# EAGLE design ADC_DSP (EAGLE 7.1.0)
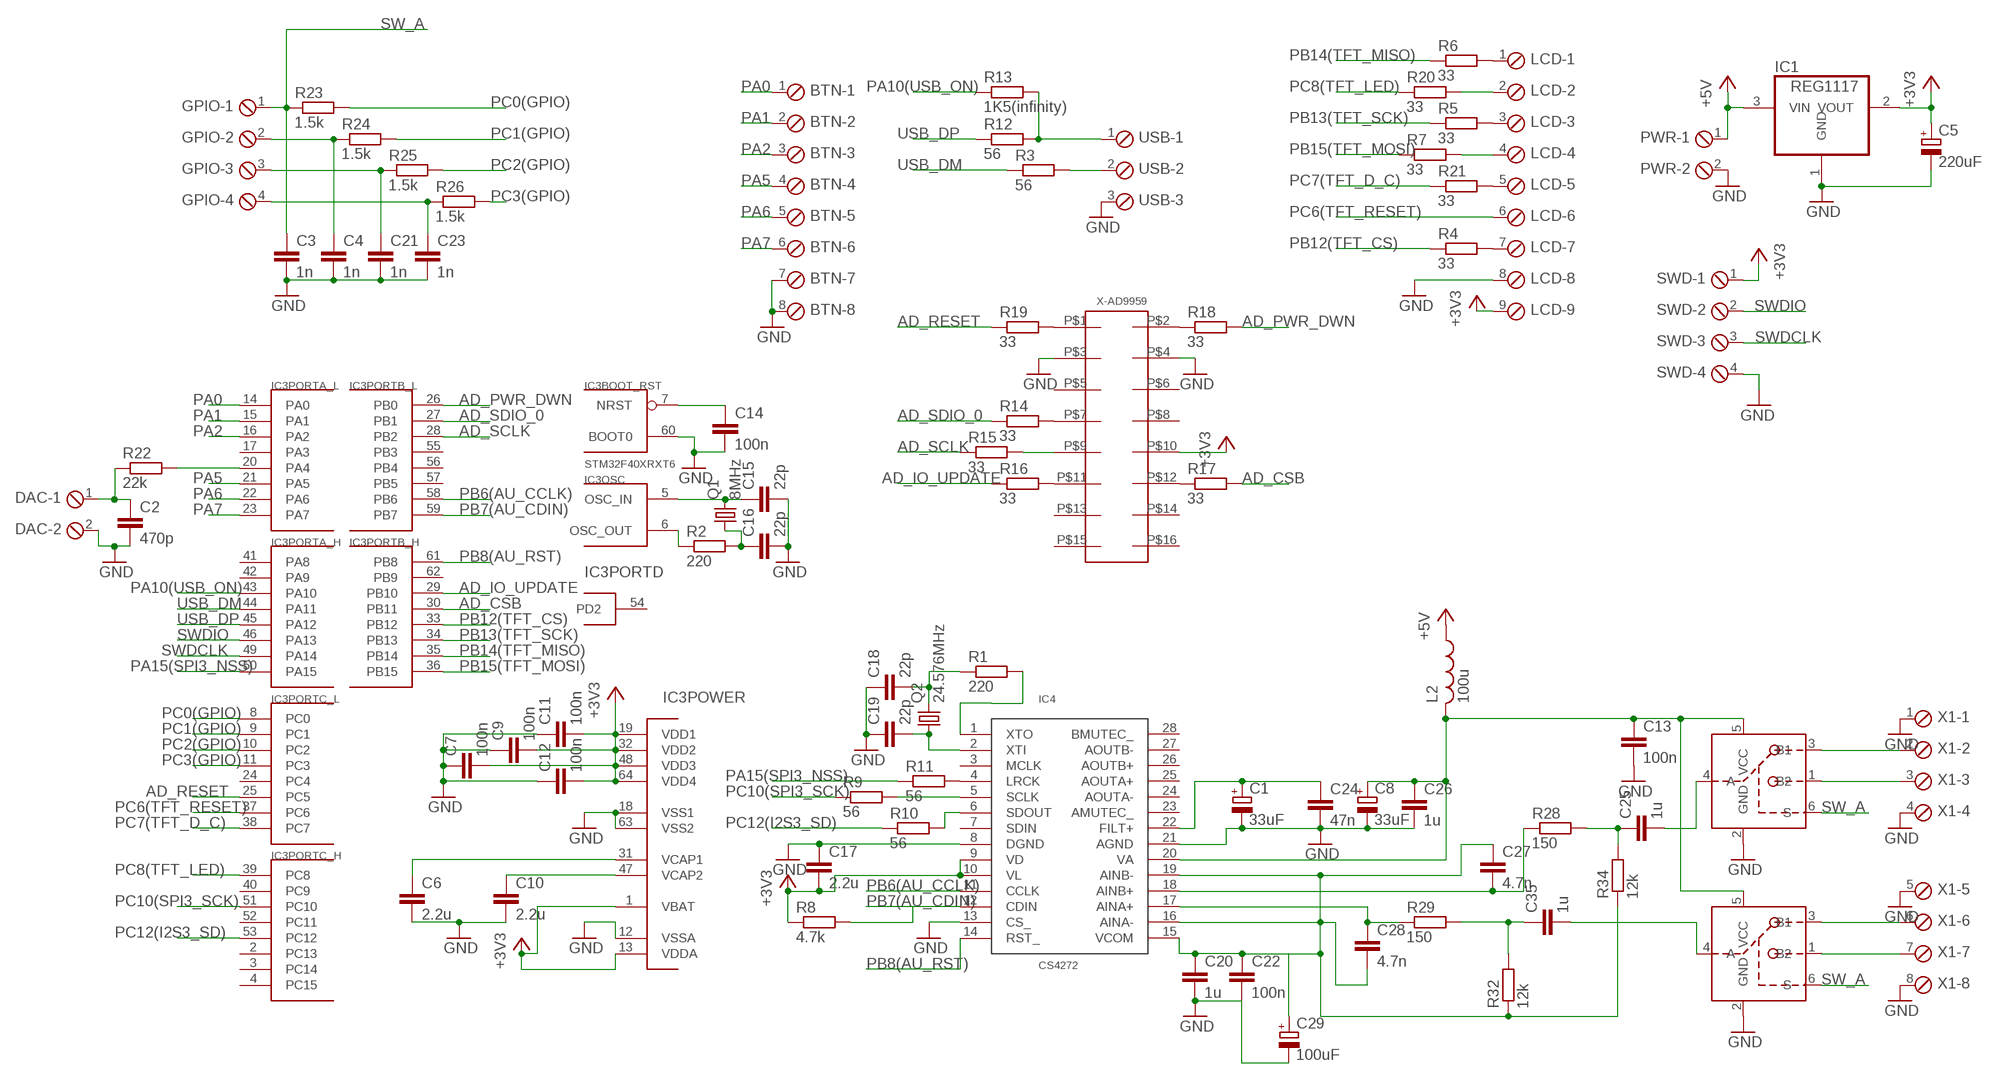
[diagram p0: schematic, sheet 1]

## Parts
BTN  MPT8  [8POL254]
C1  33uF  CPOL-EU153CLV-0605  [153CLV-0605]
C2  470p  C-EUC0805  [C0805]
C3  1n  C-EUC0805  [C0805]
C4  1n  C-EUC0805  [C0805]
C5  220uF  CPOL-EU153CLV-0605  [153CLV-0605]
C6  2.2u  C-EUC0603  [C0603]
C7  100n  C-EUC0603  [C0603]
C8  33uF  CPOL-EU153CLV-0605  [153CLV-0605]
C9  100n  C-EUC0603  [C0603]
C10  2.2u  C-EUC0603  [C0603]
C11  100n  C-EUC0603  [C0603]
C12  100n  C-EUC0603  [C0603]
C13  100n  C-EUC0603  [C0603]
C14  100n  C-EUC0603  [C0603]
C15  22p  C-EUC0603  [C0603]
C16  22p  C-EUC0603  [C0603]
C17  2.2u  C-EUC0603  [C0603]
C18  22p  C-EUC0603  [C0603]
C19  22p  C-EUC0603  [C0603]
C20  1u  C-EUC0603  [C0603]
C21  1n  C-EUC0805  [C0805]
C22  100n  C-EUC0603  [C0603]
C23  1n  C-EUC0805  [C0805]
C24  47n  C-EUC0805  [C0805]
C25  1u  C-EUC0603  [C0603]
C26  1u  C-EUC0603  [C0603]
C27  4.7n  C-EUC0805  [C0805]
C28  4.7n  C-EUC0805  [C0805]
C29  100uF  CPOL-EU153CLV-0605  [153CLV-0605]
C35  1u  C-EUC0603  [C0603]
DAC  MPT2  [2POL254]
GPIO  MPT4  [4POL254]
IC1  REG1117  [SOT223]
IC3  STM32F40XRXT6  [TQFP64]
IC4  CS4272  [TSSOP28]
L2  100u  L-US0207/12  [0207/12]
LCD  MPT9  [9POL254]
PWR  MPT2  [2POL254]
Q1  8MHz  CRYSTALHC49S  [HC49/S]
Q2  24.576MHz  CRYSTALHC49S  [HC49/S]
R1  220  R-EU_R0603  [R0603]
R2  220  R-EU_R0603  [R0603]
R3  56  R-EU_R0603  [R0603]
R4  33  R-EU_R0603  [R0603]
R5  33  R-EU_R0603  [R0603]
R6  33  R-EU_R0603  [R0603]
R7  33  R-EU_R0603  [R0603]
R8  4.7k  R-EU_R0603  [R0603]
R9  56  R-EU_R0603  [R0603]
R10  56  R-EU_R0603  [R0603]
R11  56  R-EU_R0603  [R0603]
R12  56  R-EU_R0603  [R0603]
R13  1K5(infinity)  R-EU_R0603  [R0603]
R14  33  R-EU_R0603  [R0603]
R15  33  R-EU_R0603  [R0603]
R16  33  R-EU_R0603  [R0603]
R17  33  R-EU_R0603  [R0603]
R18  33  R-EU_R0603  [R0603]
R19  33  R-EU_R0603  [R0603]
R20  33  R-EU_R0603  [R0603]
R21  33  R-EU_R0603  [R0603]
R22  22k  R-EU_R0603  [R0603]
R23  1.5k  R-EU_R0603  [R0603]
R24  1.5k  R-EU_R0603  [R0603]
R25  1.5k  R-EU_R0603  [R0603]
R26  1.5k  R-EU_R0603  [R0603]
R28  150  R-EU_R0603  [R0603]
R29  150  R-EU_R0603  [R0603]
R32  12k  R-EU_R0603  [R0603]
R34  12k  R-EU_R0603  [R0603]
SWD  MPT4  [4POL254]
U$1  SN74LVC1G3157DBVR  [SOT23-6]
U$2  SN74LVC1G3157DBVR  [SOT23-6]
USB  MPT3  [3POL254]
X1  MPT8  [8POL254]
X-AD9959  PIN8X2  [PIN8X2_SMD]

## Nets
4052_B: C4.1 GPIO.2 R24.1
+3V3: C5.+ C7.2 C9.2 C11.2 C12.2 C17.2 IC1.2(VOUT) IC3.1(POWER:VBAT) IC3.13(POWER:VDDA) IC3.19(POWER:VDD1) IC3.32(POWER:VDD2) IC3.48(POWER:VDD3) IC3.64(POWER:VDD4) IC4.9(VD) IC4.10(VL) LCD.9 R8.1 SWD.1 X-AD9959.P$10
+5V: IC1.3(VIN) L2.1 PWR.1
AD_CSB: IC3.30(PORTB_H:PB11) R17.2
AD_IO_UPDATE: IC3.29(PORTB_H:PB10) R16.1
AD_PWR_DWN: IC3.26(PORTB_L:PB0) R18.2
AD_RESET: IC3.25(PORTC_L:PC5) R19.1
AD_SCLK: IC3.28(PORTB_L:PB2) R15.1
AD_SDIO_0: IC3.27(PORTB_L:PB1) R14.1
AINB+: C27.2 IC4.18(AINB+) R28.1
AVCC: C8.+ C13.1 C26.1 IC4.20(VA) L2.2 U$1.5(VCC) U$2.5(VCC)
D+: R12.2 R13.2 USB.1
D-: R3.2 USB.2
GND: BTN.7 BTN.8 C1.- C2.2 C3.2 C4.2 C5.- C6.2 C7.1 C8.- C9.1 C10.2 C11.1 C12.1 C13.2 C14.2 C15.2 C16.2 C17.1 C18.1 C19.1 C20.2 C21.2 C22.2 C23.2 C24.2 C26.2 C29.- DAC.2 IC1.1(GND) IC3.12(POWER:VSSA) IC3.18(POWER:VSS1) IC3.60(BOOT_RST:BOOT0) IC3.63(POWER:VSS2) IC4.8(DGND) IC4.13(CS_) IC4.21(AGND) LCD.8 PWR.2 SWD.4 U$1.2(GND) U$2.2(GND) USB.3 X1.1 X1.4 X1.5 X1.8 X-AD9959.P$3 X-AD9959.P$4
N$1: C10.1 IC3.47(POWER:VCAP2)
N$2: C6.1 IC3.31(POWER:VCAP1)
N$4: C14.1 IC3.7(BOOT_RST:NRST)
N$5: C15.1 IC3.5(OSC:OSC_IN) Q1.2
N$6: C16.1 Q1.1 R2.2
N$7: C19.2 IC4.2(XTI) Q2.1
N$8: C18.2 Q2.2 R1.1
N$9: IC4.4(LRCK) R11.2
N$10: IC4.5(SCLK) R9.2
N$11: IC4.6(SDOUT) R10.2
N$12: C1.+ C24.1 IC4.22(FILT+)
N$13: C25.2 U$1.4(A)
N$14: R14.2 X-AD9959.P$7
N$15: C35.2 U$2.4(A)
N$17: IC4.1(XTO) R1.2
N$18: C28.1 IC4.17(AINA+) R29.1
N$19: IC3.6(OSC:OSC_OUT) R2.1
N$20: LCD.1 R6.2
N$21: LCD.3 R5.2
N$22: LCD.2 R20.2
N$23: R15.2 X-AD9959.P$9
N$24: LCD.4 R7.2
N$26: U$1.3(B1) X1.2
N$28: U$1.1(B2) X1.3
N$29: R16.2 X-AD9959.P$11
N$30: U$2.3(B1) X1.6
N$31: R17.1 X-AD9959.P$12
N$32: R18.1 X-AD9959.P$2
N$33: R19.2 X-AD9959.P$1
N$34: LCD.7 R4.2
N$35: LCD.5 R21.2
N$36: IC3.20(PORTA_L:PA4) R22.2
N$37: C2.1 DAC.1 R22.1
N$38: U$2.1(B2) X1.7
N$39: C25.1 R28.2 R34.2
N$40: C21.1 GPIO.3 R25.1
N$41: C23.1 GPIO.4 R26.1
N$50: C35.1 R29.2 R32.2
PA0: BTN.1 IC3.14(PORTA_L:PA0)
PA1: BTN.2 IC3.15(PORTA_L:PA1)
PA2: BTN.3 IC3.16(PORTA_L:PA2)
PA5: BTN.4 IC3.21(PORTA_L:PA5)
PA6: BTN.5 IC3.22(PORTA_L:PA6)
PA7: BTN.6 IC3.23(PORTA_L:PA7)
PA10(USB_ON): IC3.43(PORTA_H:PA10) R13.1
PA15(SPI3_NSS): IC3.50(PORTA_H:PA15) R11.1
PB6(AU_CCLK): IC3.58(PORTB_L:PB6) IC4.11(CCLK)
PB7(AU_CDIN): IC3.59(PORTB_L:PB7) IC4.12(CDIN) R8.2
PB8(AU_RST): IC3.61(PORTB_H:PB8) IC4.14(RST_)
PB12(TFT_CS): IC3.33(PORTB_H:PB12) R4.1
PB13(TFT_SCK): IC3.34(PORTB_H:PB13) R5.1
PB14(TFT_MISO): IC3.35(PORTB_H:PB14) R6.1
PB15(TFT_MOSI): IC3.36(PORTB_H:PB15) R7.1
PC0(GPIO): IC3.8(PORTC_L:PC0) R23.2
PC1(GPIO): IC3.9(PORTC_L:PC1) R24.2
PC2(GPIO): IC3.10(PORTC_L:PC2) R25.2
PC3(GPIO): IC3.11(PORTC_L:PC3) R26.2
PC6(TFT_RESET): IC3.37(PORTC_L:PC6) LCD.6
PC7(TFT_D_C): IC3.38(PORTC_L:PC7) R21.1
PC8(TFT_LED): IC3.39(PORTC_H:PC8) R20.1
PC10(SPI3_SCK): IC3.51(PORTC_H:PC10) R9.1
PC12(I2S3_SD): IC3.53(PORTC_H:PC12) R10.1
SW_A: C3.1 GPIO.1 R23.1 U$1.6(S) U$2.6(S)
SWDCLK: IC3.49(PORTA_H:PA14) SWD.3
SWDIO: IC3.46(PORTA_H:PA13) SWD.2
USB_DM: IC3.44(PORTA_H:PA11) R3.1
USB_DP: IC3.45(PORTA_H:PA12) R12.1
VCOM: C20.1 C22.1 C27.1 C28.2 C29.+ IC4.15(VCOM) IC4.16(AINA-) IC4.19(AINB-) R32.1 R34.1
Unconnected: IC3.2(PORTC_H:PC13) IC3.3(PORTC_H:PC14) IC3.4(PORTC_H:PC15) IC3.17(PORTA_L:PA3) IC3.24(PORTC_L:PC4) IC3.40(PORTC_H:PC9) IC3.41(PORTA_H:PA8) IC3.42(PORTA_H:PA9) IC3.52(PORTC_H:PC11) IC3.54(PORTD:PD2) IC3.55(PORTB_L:PB3) IC3.56(PORTB_L:PB4) IC3.57(PORTB_L:PB5) IC3.62(PORTB_H:PB9) IC4.3(MCLK) IC4.7(SDIN) IC4.23(AMUTEC_) IC4.24(AOUTA-) IC4.25(AOUTA+) IC4.26(AOUTB+) IC4.27(AOUTB-) IC4.28(BMUTEC_) X-AD9959.P$5 X-AD9959.P$6 X-AD9959.P$8 X-AD9959.P$13 X-AD9959.P$14 X-AD9959.P$15 X-AD9959.P$16

## Library data of the parts
BTN X1 = con-phoenix-254:MPT8: PHOENIX CONNECTOR; OC_FARNELL: unknown; OC_NEWARK: unknown
C1 C5 C8 C29 = rcl:CPOL-EU: POLARIZED CAPACITOR, European symbol
C2-C4 C6 C7 C9-C28 C35 = rcl:C-EU: CAPACITOR, European symbol
DAC PWR = con-phoenix-254:MPT2: PHOENIX CONNECTOR; OC_FARNELL: unknown; OC_NEWARK: unknown
GPIO SWD = con-phoenix-254:MPT4: PHOENIX CONNECTOR; OC_FARNELL: unknown; OC_NEWARK: unknown
IC1 = burr-brown:REG1117: 800mA and 1A Low Dropout (LDO) Positive Regulator 1.8V, 2.5V, 2.85V, 3.3V, 5V, and Adj; MPN: REG1117; OC_FARNELL: 1097566; OC_NEWARK: 14P6981
IC3 = stm32:STM32F40XRXT6: STM32F40X LQFP64
IC4 = balmer:CS4272: 24-Bit, 192 kHz Stereo Audio CODEC
L2 = rcl:L-US: INDUCTOR, American symbol
LCD = con-phoenix-254:MPT9: PHOENIX CONNECTOR; OC_FARNELL: unknown; OC_NEWARK: unknown
Q1 Q2 = crystal:CRYSTAL: CRYSTAL; OC_FARNELL: 1667008; OC_NEWARK: unknown
R1-R26 R28 R29 R32 R34 = rcl:R-EU_: RESISTOR, European symbol
U$1 U$2 = balmer:SN74LVC1G3157DBVR: SINGLE-POLE DOUBLE-THROW ANALOG SWITCH
USB = con-phoenix-254:MPT3: PHOENIX CONNECTOR; OC_FARNELL: unknown; OC_NEWARK: unknown
X-AD9959 = balmer:PIN8X2: 2.54mm pins dual

## Board
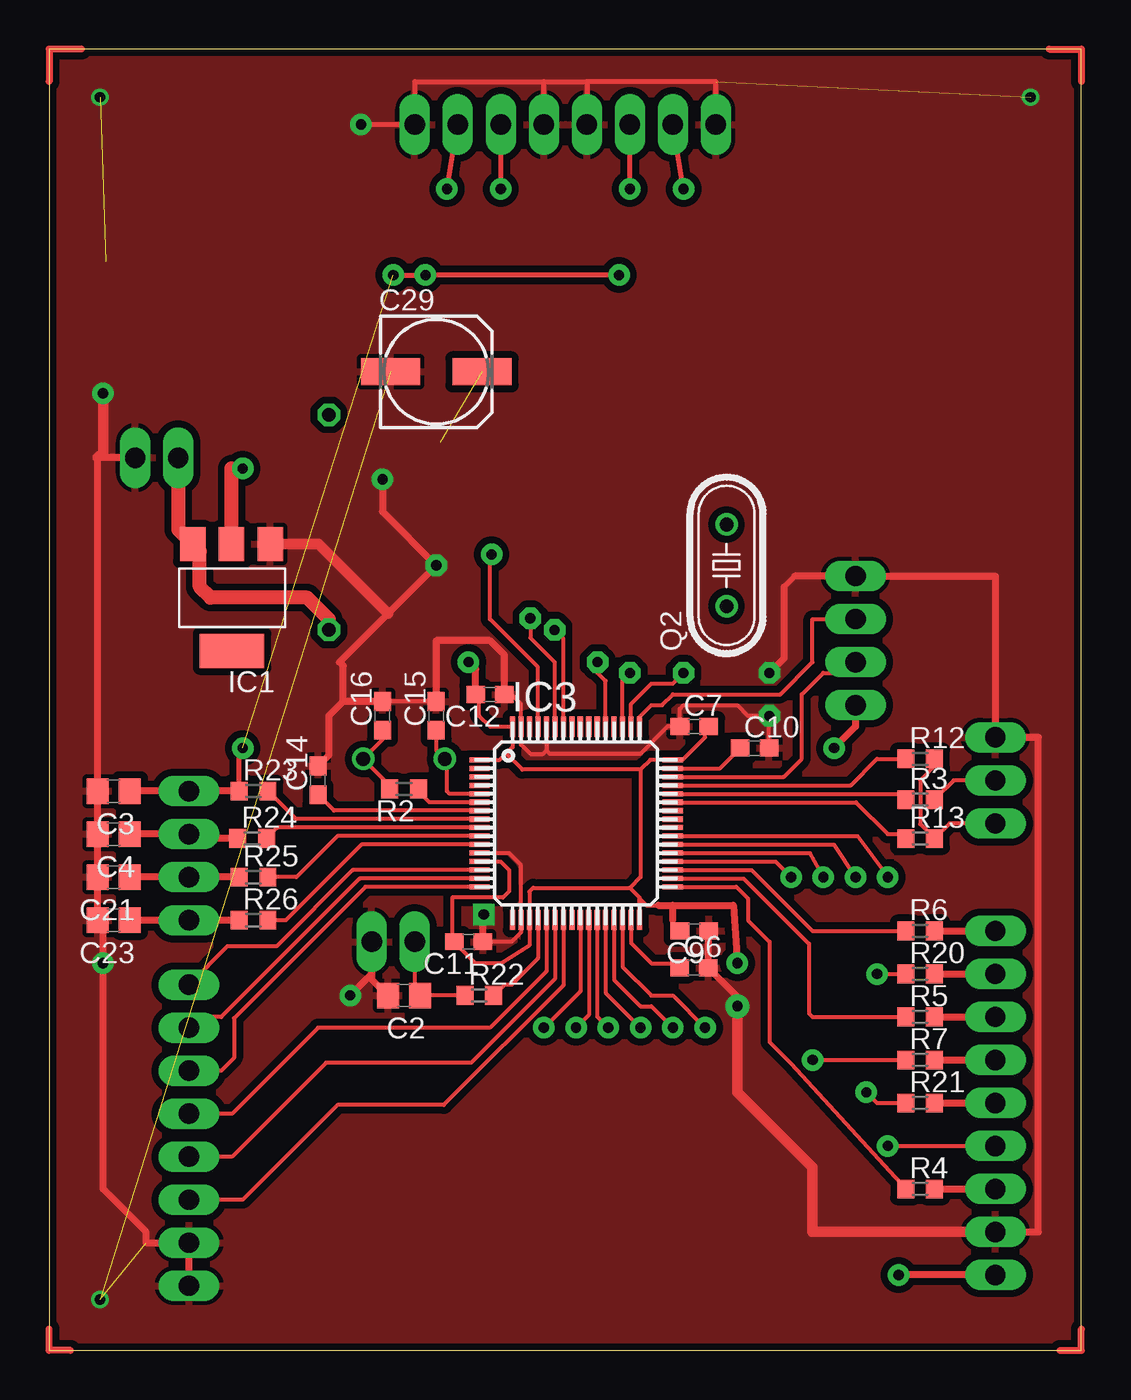
[diagram p1: board, top side]
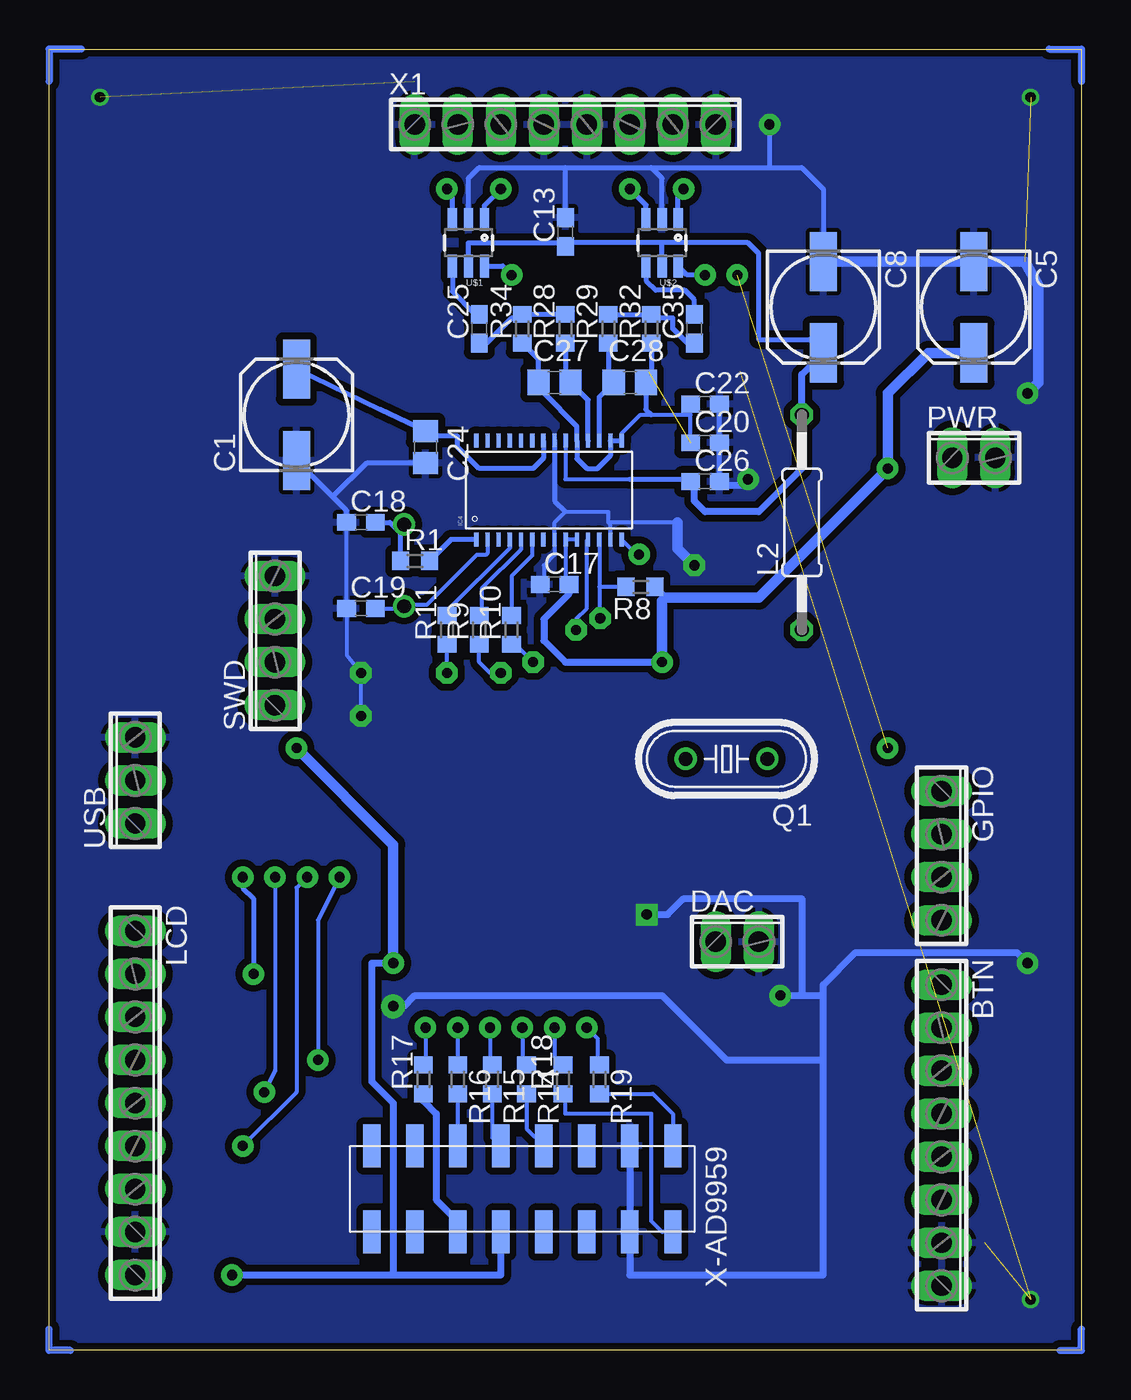
[diagram p2: board, bottom side, seen from below]

Size 60.95 x 76.83 mm. Coordinates in mm from the lower left corner, seen from the top.
Outline: 0,0 60.95,0 60.95,76.83 0,76.83 0,0
Copper layers (1*16): Top 0.035mm / dielectric 1.5mm / Bottom 0.035mm
Design rules "ITEADstudio_DRC": minimum track width 6mil, minimum drill 12mil, track to track 6mil, track to pad 6mil, pad to pad 6mil, via to via 6mil, smd to smd 0mil, copper to edge 10mil, drill to drill 10mil, minimum pad ring 10mil, minimum via ring 6mil, stop-mask expansion 2mil, vias tented up to drill 100mil, thermal gap 10mil

### Footprints (pad centres in the part's own frame; a part is rotated, then mirrored left to right if it is on the bottom)
8POL254 = drill 1.2 long: 1 -8.89,0; 2 -6.35,0; 3 -3.81,0; 4 -1.27,0; 5 1.27,0; 6 3.81,0; 7 6.35,0; 8 8.89,0
153CLV-0605 = smd 3.5 x 1.6: + 2.7,0; - -2.7,0
C0805 = smd 1.3 x 1.5: 1 -0.95,0; 2 0.95,0
C0603 = smd 1.1 x 1: 1 -0.85,0; 2 0.85,0
2POL254 = drill 1.2 long: 1 -1.27,0; 2 1.27,0
4POL254 = drill 1.2 long: 1 -3.81,0; 2 -1.27,0; 3 1.27,0; 4 3.81,0
SOT223 = smd 1.499 x 2.007: 1 -2.261,-3.15; 2 0.025,-3.15; 3 2.311,-3.15 | smd 3.81 x 2.007: 4 0,3.15
TQFP64 = smd 1.2 x 0.3: 1 -5.7,3.75; 2 -5.7,3.25; 3 -5.7,2.75; 4 -5.7,2.25; 5 -5.7,1.75; 6 -5.7,1.25; 7 -5.7,0.75; 8 -5.7,0.25; 9 -5.7,-0.25; 10 -5.7,-0.75; 11 -5.7,-1.25; 12 -5.7,-1.75; 13 -5.7,-2.25; 14 -5.7,-2.75; 15 -5.7,-3.25; 16 -5.7,-3.75; 33 5.7,-3.75; 34 5.7,-3.25; 35 5.7,-2.75; 36 5.7,-2.25; 37 5.7,-1.75; 38 5.7,-1.25; 39 5.7,-0.75; 40 5.7,-0.25; 41 5.7,0.25; 42 5.7,0.75; 43 5.7,1.25; 44 5.7,1.75; 45 5.7,2.25; 46 5.7,2.75; 47 5.7,3.25; 48 5.7,3.75 | smd 0.3 x 1.2: 17 -3.75,-5.7; 18 -3.25,-5.7; 19 -2.75,-5.7; 20 -2.25,-5.7; 21 -1.75,-5.7; 22 -1.25,-5.7; 23 -0.75,-5.7; 24 -0.25,-5.7; 25 0.25,-5.7; 26 0.75,-5.7; 27 1.25,-5.7; 28 1.75,-5.7; 29 2.25,-5.7; 30 2.75,-5.7; 31 3.25,-5.7; 32 3.75,-5.7; 49 3.75,5.7; 50 3.25,5.7; 51 2.75,5.7; 52 2.25,5.7; 53 1.75,5.7; 54 1.25,5.7; 55 0.75,5.7; 56 0.25,5.7; 57 -0.25,5.7; 58 -0.75,5.7; 59 -1.25,5.7; 60 -1.75,5.7; 61 -2.25,5.7; 62 -2.75,5.7; 63 -3.25,5.7; 64 -3.75,5.7
TSSOP28 = smd 0.8 x 0.25: 1 -2.921,4.623; 2 -2.921,3.962; 3 -2.921,3.302; 4 -2.921,2.642; 5 -2.921,1.981; 6 -2.921,1.321; 7 -2.921,0.66; 8 -2.927,0; 9 -2.921,-0.66; 10 -2.921,-1.321; 11 -2.921,-1.981; 12 -2.921,-2.642; 13 -2.921,-3.302; 14 -2.921,-3.962; 15 2.921,-3.962; 16 2.921,-3.302; 17 2.921,-2.642; 18 2.921,-1.981; 19 2.921,-1.321; 20 2.921,-0.66; 21 2.927,0; 22 2.921,0.66; 23 2.921,1.321; 24 2.921,1.981; 25 2.921,2.642; 26 2.921,3.302; 27 2.921,3.962; 28 2.921,4.623
0207/12 = drill 0.813 octagon: 1 -6.35,0; 2 6.35,0
9POL254 = drill 1.2 long: 1 -10.16,0; 2 -7.62,0; 3 -5.08,0; 4 -2.54,0; 5 0,0; 6 2.54,0; 7 5.08,0; 8 7.62,0; 9 10.16,0
HC49/S = drill 0.813: 1 -2.413,0; 2 2.413,0
R0603 = smd 1 x 1.1: 1 -0.85,0; 2 0.85,0
SOT23-6 = smd 0.55 x 1.35: 1 -0.95,-1.375; 2 0,-1.375; 3 0.95,-1.375; 4 0.95,1.375; 5 0,1.375; 6 -0.95,1.375
3POL254 = drill 1.2 long: 1 -2.54,0; 2 0,0; 3 2.54,0
PIN8X2_SMD = smd 2.54 x 1.016: P$1 -2.54,8.89; P$2 2.54,8.89; P$3 -2.54,6.35; P$4 2.54,6.35; P$5 -2.54,3.81; P$6 2.54,3.81; P$7 -2.54,1.27; P$8 2.54,1.27; P$9 -2.54,-1.27; P$10 2.54,-1.27; P$11 -2.54,-3.81; P$12 2.54,-3.81; P$13 -2.54,-6.35; P$14 2.54,-6.35; P$15 -2.54,-8.89; P$16 2.54,-8.89

### Placement (x,y rotation side)
BTN  8.26,12.7 270 bottom
C1  46.35,55.24 90 bottom
C2  20.95,20.95 180 top
C3  3.81,33.02 180 top
C4  3.81,30.48 180 top
C5  6.35,61.59 270 bottom
C6  38.08,22.59 0 top
C7  38.1,36.83 0 top
C8  15.24,61.59 270 bottom
C9  38.1,24.77 180 top
C10  41.66,35.56 0 top
C11  24.77,24.13 180 top
C12  26.04,38.73 180 top
C13  30.48,66.04 90 bottom
C14  15.88,33.66 90 top
C15  22.86,37.47 90 top
C16  19.68,37.47 90 top
C17  31.11,45.22 0 bottom
C18  42.55,48.9 0 bottom
C19  42.55,43.81 0 bottom
C20  22.23,53.59 0 bottom
C21  3.81,27.94 180 top
C22  22.23,55.88 0 bottom
C23  3.81,25.4 180 top
C24  38.73,53.34 270 bottom
C25  35.56,60.33 90 bottom
C26  22.23,51.3 0 bottom
C27  31.11,57.15 0 bottom
C28  26.67,57.15 0 bottom
C29  22.86,57.78 0 top
C35  22.86,60.33 90 bottom
DAC  20.32,24.13 0 bottom
GPIO  8.26,29.21 270 bottom
IC1  10.79,44.45 180 top
IC3  31.11,31.11 0 top
IC4  31.11,50.8 90 bottom
L2  16.51,48.9 90 bottom
LCD  55.88,14.61 270 bottom
PWR  6.35,52.7 0 bottom
Q1  20.95,34.92 180 bottom
Q2  40.01,46.35 90 top
R1  39.35,46.62 0 bottom
R2  20.95,33.15 180 top
R3  51.44,32.52 0 top
R4  51.44,9.53 0 top
R5  51.44,19.68 0 top
R6  51.44,24.77 0 top
R7  51.44,17.14 0 top
R8  26.04,45.09 180 bottom
R9  35.56,42.55 90 bottom
R10  33.66,42.55 90 bottom
R11  37.47,42.55 90 bottom
R12  51.44,34.92 0 top
R13  51.44,30.22 0 top
R14  32.77,16 270 bottom
R15  34.8,16 270 bottom
R16  36.83,16 270 bottom
R17  38.86,16 90 bottom
R18  30.61,16 90 bottom
R19  28.46,16 270 bottom
R20  51.44,22.23 0 top
R21  51.44,14.61 0 top
R22  25.4,20.95 0 top
R23  12.06,33.02 0 top
R24  11.98,30.23 0 top
R25  12.06,27.94 0 top
R26  12.06,25.4 0 top
R28  30.48,60.33 90 bottom
R29  27.94,60.33 90 bottom
R32  25.4,60.33 90 bottom
R34  33.02,60.33 90 bottom
SWD  47.62,41.91 90 bottom
U$1  36.2,65.41 180 bottom
U$2  24.77,65.41 180 bottom
USB  55.88,33.66 90 bottom
X1  30.48,72.39 0 bottom
X-AD9959  33.02,9.53 270 bottom

### Tracks (layer width: path | path; a pad name or v marks a point on that pad's centre or on a via)
4052_B
  Top 0.406: R24.1 8.51,30.23 GPIO.2 C4.1
+3V3  (via drill 0.6 pad 1.27)
  Top 0.25: 34.29,27.3 28.57,27.3 28.36,27.09 IC3.19 28.36,23.92 26.67,22.86 25.18,22.86 C11.2 | IC3.32 34.87,26.67 | 34.87,26.67 34.87,26.73 34.29,27.3 | 34.92,34.29 35.5,34.87 IC3.48 37.41,34.87 38.73,36.2 38.73,36.62 C7.2 | 34.92,34.29 34.92,27.94 34.29,27.3 | C12.2 25.4,38.52 25.4,37.47 26.05,36.81 IC3.64 27.36,35.62 26.99,35.24 | IC3.1 26.61,34.87 26.99,35.24 | 34.92,34.29 27.94,34.29 26.99,35.24 | 34.87,26.67 35.26,26.27 35.95,26.27 | 36.83,25.4 36.83,25.18 C9.2 | IC3.13 26.66,28.86 27.17,28.36 27.17,27.11 26.8,26.73 23.8,26.73 23.8,24.25 C11.2 | 24.13,24.34 C11.2
  Top 0.406: 35.95,26.27 36.83,26.27 | 36.83,26.27 40.4,26.27 v40.64,22.86 | LCD.9 v50.16,4.45 | SWD.1 47.62,36.83 v46.35,35.56 | 36.83,25.4 36.83,26.27 | v11.43,52.07 10.77,52.07 | C12.2 25.18,40.22 v24.77,40.64
  Top 0.813: IC1.2 10.77,52.07
  Bottom 0.25: IC4.10 IC4.9 30.45,45.41 C17.2
  Bottom 0.406: X-AD9959.P$10 34.29,4.45 40.64,4.45 | v50.16,4.45 40.64,4.45 | R8.1 24.55,44.45 24.77,44.23 | C17.2 30.27,44.66 31.75,43.18 31.75,41.91 30.48,40.64 v24.77,40.64 | v40.64,22.86 41.91,22.86 41.91,15.88 40.64,14.61 40.64,4.45
  Bottom 0.61: v24.77,40.64 24.77,44.23 | 24.55,44.45 19.05,44.45 v11.43,52.07 11.43,56.52 9.05,58.9 C5.+ | v40.64,22.86 40.64,29.84 v46.35,35.56
+5V
  Top 0.813: PWR.1 7.62,48.46 IC1.3 8.89,47.19 8.89,45.09 9.53,44.45 15.24,44.45 16.51,43.18 L2.1
AD_CSB  (via drill 0.6 pad 1.27)
  Top 0.25: IC3.30 33.87,22.65 35.56,20.95 36.83,20.95 v38.73,19.05
  Bottom 0.25: v38.73,19.05 38.73,16.98 R17.2
AD_IO_UPDATE  (via drill 0.6 pad 1.27)
  Top 0.25: IC3.29 33.37,21.88 34.92,20.32 35.56,20.32 v36.83,19.05
  Bottom 0.25: v36.83,19.05 R16.1
AD_PWR_DWN  (via drill 0.6 pad 1.27)
  Top 0.25: IC3.26 31.86,19.8 v31.11,19.05
  Bottom 0.25: v31.11,19.05 31.11,17.35 R18.2
AD_RESET  (via drill 0.6 pad 1.27)
  Top 0.25: IC3.25 31.36,21.2 v29.21,19.05
  Bottom 0.25: v29.21,19.05 28.57,18.41 28.57,16.96 R19.1
AD_SCLK  (via drill 0.6 pad 1.27)
  Top 0.25: IC3.28 32.87,21.11 v34.92,19.05
  Bottom 0.25: v34.92,19.05 34.92,16.98 R15.1
AD_SDIO_0  (via drill 0.6 pad 1.27)
  Top 0.25: IC3.27 32.37,19.7 v33.02,19.05
  Bottom 0.25: v33.02,19.05 33.02,17.1 R14.1
AINB+
  Bottom 0.305: IC4.18 29.13,56.12 C27.2 30.48,57.47 R28.1
AVCC
  Bottom 0.25: IC4.20 30.45,51.46 30.48,51.44 26.67,51.44
  Bottom 0.305: C8.+ 16.04,59.69 19.05,59.69 19.05,64.77 19.68,65.41 24.77,65.41 | U$2.5 24.77,65.41 | 24.77,65.41 30.27,65.41 C13.1 30.7,65.41 36.2,65.41 U$1.5 | 26.67,51.44 23.21,51.44 C26.1
  Bottom 0.406: C8.+ 16.51,57.62 L2.2 16.51,52.07 19.05,49.53 22.23,49.53 22.86,50.16 22.86,51.09 C26.1
D+
  Top 0.25: R12.2 52.28,34.51 51.44,33.66 51.44,31.07 R13.2 53.18,31.11 USB.1
D-
  Top 0.25: USB.2 53.42,33.66 R3.2
GND  (via drill 0.6 pad 1.02, 0.6 pad 1.27, 0.6 pad 1.42)  (4 unrouted)
  Top 0.25: C12.1 27.3,38.73 27.86,38.17 IC3.63 27.86,35.77 28.41,35.23 29.16,35.23 29.36,35.42 | IC3.60 29.36,35.42 | 29.36,35.42 29.57,35.23 34.91,35.23 36.52,36.83 C7.1 37.25,37.88 37.47,38.1 40.64,38.1 41.27,37.47 v42.55,37.47 42.51,37.43 C10.2 | C15.2 C16.2 | C11.1 27.3,24.13 27.86,24.69 IC3.18 27.86,28.65 27.15,29.36 IC3.12
  Top 0.305: X1.1 39.37,74.93 31.75,74.93 | 31.75,74.93 X1.4 | X1.5 29.21,74.93 | 29.21,74.93 31.75,74.93 | 29.21,74.93 21.59,74.93 X1.8 v18.41,72.39 | 43.4,45.09 44.03,45.72
  Top 0.406: C16.2 17.36,38.31 | 17.36,38.31 16.51,37.47 16.51,35.14 C14.2 | DAC.2 19.05,22.23 | 19.05,22.23 v17.78,20.95 | 19.05,22.23 19.05,21.91 C2.2 | BTN.8 BTN.7 5.71,6.35 5.71,6.99 3.17,9.53 v3.17,22.86 3.17,25.09 C23.2 C21.2 C4.2 C3.2 2.86,52.7 PWR.2 | C11.1 25.61,25.68 v25.67,25.73 | v40.64,20.32 40.64,20.88 C6.2 38.93,24.75 C9.1 | 43.4,45.09 43.4,40.85 v42.55,40.01 | LCD.8 58.42,6.99 58.42,36.2 USB.3 55.88,45.72 SWD.4 44.03,45.72 | 17.36,38.31 17.36,40.42 17.14,40.64 20,43.5 v22.86,46.35 19.68,49.53 v19.68,51.44 | C12.1 26.89,41.06 26.04,41.91 22.86,41.91 C15.2
  Top 0.61: v3.17,56.52 3.17,53.02 2.86,52.7 | IC1.1 15.9,47.6 20,43.5 | v40.64,20.32 40.64,15.24 45.09,10.79 45.09,6.99 LCD.8
  Bottom 0.25: C18.1 C19.1 43.4,41.06 v42.55,40.01 v42.55,37.47 | C17.1 31.75,45.44 31.75,46.35 31.11,46.99 IC4.8 31.11,48.9 30.48,49.53 27.94,49.53 27.94,48.9 | 23.86,48.9 27.94,48.9 | IC4.13 27.81,48.77 27.94,48.9
  Bottom 0.305: IC4.21 31.11,50.16 30.48,49.53 | C22.2 C20.2 C26.2 21.59,51.09 | C18.1 43.4,49.59 44.21,50.4 | 44.21,50.4 C1.- | U$1.2 36.2,69.22 35.56,69.85 30.48,69.85 | 30.48,69.85 25.4,69.85 | 25.4,69.85 18.41,69.85 | 18.41,69.85 16.51,69.85 15.24,68.58 C8.- | C13.2 30.48,69.85 | U$2.2 24.77,69.22 25.4,69.85 | v18.41,72.39 18.41,69.85 | C24.2 42.23,52.39 44.21,50.4
  Bottom 0.406: 23.23,46.72 v22.86,46.35 | v17.78,20.95 16.51,20.95 | 16.51,20.95 15.24,20.95 | v25.67,25.73 24.43,25.73 23.5,26.67 16.51,26.67 16.51,20.95 | 15.24,17.14 15.24,4.45 26.67,4.45 X-AD9959.P$4 X-AD9959.P$3 | 15.24,17.14 15.24,20.95 | v40.64,20.32 40.01,20.32 39.37,20.95 24.77,20.95 20.95,17.14 15.24,17.14 | 21.59,51.09 20.04,51.09 v19.68,51.44 | 15.24,20.95 15.24,21.59 13.34,23.5 3.81,23.5 v3.17,22.86
  Bottom 0.61: v3.17,56.52 2.54,57.15 2.54,62.87 3.33,64.3 C5.- C8.- | 23.86,48.9 23.86,47.35 23.23,46.72
  other vias: 3,74 57.96,74 3,3
  pour Bottom (isolate 0.406): 0,77.47 60.96,77.47 60.96,-0.64 0,-0.64
  pour Top (isolate 0.406): 0,77.47 60.96,77.47 60.96,-0.64 0,-0.64
N$1
  Top 0.25: IC3.47 39.62,34.37 C10.1
N$2
  Top 0.25: IC3.31 34.37,24.05 35.56,22.86 36.96,22.86 C6.1
N$4
  Top 0.25: C14.1 16.82,31.86 IC3.7
N$5
  Top 0.25: IC3.5 23.65,32.87 23.5,33.02 23.5,34.8 Q1.2 22.86,35.43 C15.1
N$6
  Top 0.25: C16.1 19.68,36.07 Q1.1 20.11,33.36 R2.2
N$7
  Bottom 0.25: C19.2 40.13,43.81 Q2.1 39.92,44.02 38.66,44.02 35.71,46.98 35.16,46.98 35.08,47.06 IC4.2
N$8
  Bottom 0.305: R1.1 40.2,48.26 | 40.2,48.26 40.2,48.57 Q2.2 | C18.2 40.84,48.9 40.2,48.26
N$9
  Bottom 0.25: IC4.4 33.76,47.38 37.47,43.67 R11.2
N$10
  Bottom 0.25: IC4.5 33.1,47.29 35.41,44.98 35.41,43.54 R9.2
N$11
  Bottom 0.25: IC4.6 32.44,46.94 33.66,45.72 R10.2
N$12
  Bottom 0.305: IC4.22 31.77,52.68 32.38,52.07 35.56,52.07 36.83,53.34 36.83,53.98 38.42,53.98 C24.1 41.43,55.56 C1.+
N$13
  Bottom 0.305: C25.2 35.77,61.17 37.15,62.55 U$1.4
N$14
  Bottom 0.25: R14.2 32.77,13.09 X-AD9959.P$7
N$15
  Bottom 0.305: C35.2 22.86,62.05 23.42,62.6 25.14,62.6 25.71,63.18 U$2.4
N$17
  Bottom 0.305: IC4.1 37.24,47.88 R1.2
N$18
  Bottom 0.305: IC4.17 28.47,56.3 C28.1 27.94,57.47 R29.1
N$19
  Top 0.25: IC3.6 22.46,32.37 21.8,33.02 R2.1
N$20
  Top 0.406: R6.2 LCD.1
N$21
  Top 0.406: R5.2 LCD.3
N$22
  Top 0.406: R20.2 LCD.2
N$23
  Bottom 0.25: R15.2 34.8,12.57 X-AD9959.P$9
N$24
  Top 0.406: R7.2 LCD.4
N$25
  Top 0.406: 1.27,0 0,0 0,1.27
N$26  (via drill 0.6 pad 1.27)
  Top 0.305: v37.47,68.58 X1.2
  Bottom 0.305: U$1.3 37.15,68.27 v37.47,68.58
N$27
  Bottom 0.406: 1.27,0 0,0 0,1.27
N$28  (via drill 0.6 pad 1.27)
  Top 0.305: v34.29,68.58 X1.3
  Bottom 0.305: U$1.1 35.24,67.62 v34.29,68.58
N$29
  Bottom 0.25: R16.2 X-AD9959.P$11
N$30  (via drill 0.6 pad 1.27)
  Top 0.305: v26.67,68.58 X1.6
  Bottom 0.305: U$2.3 25.71,67.62 v26.67,68.58
N$31
  Bottom 0.406: R17.1 38.86,14.73 38.1,13.97 38.1,8.89 36.83,7.62 X-AD9959.P$12
N$32
  Bottom 0.25: X-AD9959.P$2 24.77,6.99 25.4,7.62 25.4,13.97 30.48,13.97 30.48,15.02 R18.1
N$33
  Bottom 0.25: R19.2 25.31,15.15 24.13,13.97 X-AD9959.P$1
N$34
  Top 0.406: R4.2 LCD.7
N$35
  Top 0.406: R21.2 LCD.5
N$36
  Top 0.25: IC3.20 28.86,23.15 27.3,21.59 26.89,21.59 R22.2
N$37
  Top 0.25: R22.1 C2.1 21.59,21.27 DAC.1
N$38  (via drill 0.6 pad 1.27)
  Top 0.305: v23.5,68.58 X1.7
  Bottom 0.305: U$2.1 23.82,68.27 v23.5,68.58
N$39
  Bottom 0.305: R28.2 R34.2 33.23,60.96 33.66,60.96 35.14,59.48 C25.1
N$40
  Top 0.406: R25.1 GPIO.3 C21.1
N$41
  Top 0.406: R26.1 GPIO.4 C23.1
N$42
  Top 0.406: 1.91,76.83 0,76.83 0,74.93
N$43
  Top 0.406: 59.05,76.83 60.96,76.83 60.96,74.93
N$44
  Top 0.406: 59.69,0 60.96,0 60.96,1.27
N$45
  Bottom 0.406: 59.69,0 60.96,0 60.96,1.27
N$46
  Bottom 0.406: 59.05,76.83 60.96,76.83 60.96,74.93
N$47
  Bottom 0.406: 1.91,76.83 0,76.83 0,74.93
N$50
  Bottom 0.305: R29.2 R32.2 25.18,60.96 24.13,60.96 24.13,60.33 23.28,59.48 C35.1
PA0
  Top 0.25: IC3.14 17.93,28.36 13.42,23.86 10.52,23.86 BTN.1
PA1
  Top 0.25: IC3.15 18.34,27.86 10.16,19.68 8.89,19.68 BTN.2
PA2
  Top 0.25: IC3.16 18.68,27.36 10.92,19.61 10.92,17.27 10.16,16.51 BTN.3
PA5
  Top 0.25: IC3.21 29.36,22.38 26.04,19.05 15.88,19.05 10.79,13.97 BTN.4
PA6
  Top 0.25: IC3.22 29.86,21.93 24.92,16.98 16.34,16.98 10.79,11.43 BTN.5
PA7
  Top 0.25: IC3.23 30.36,21.55 23.3,14.48 17.02,14.48 11.43,8.89 BTN.6
PA10(USB_ON)
  Top 0.25: IC3.43 47.65,32.37 49.53,30.48 50.33,30.48 R13.1
PA15(SPI3_NSS)  (via drill 0.6 pad 1.27)
  Top 0.25: IC3.50 34.37,38.17 35.56,39.37 36.83,39.37 v37.47,40.01
  Bottom 0.25: v37.47,40.01 R11.1
PB6(AU_CCLK)  (via drill 0.6 pad 1.27)
  Top 0.25: IC3.58 30.36,42.02 v29.84,42.55
  Bottom 0.25: v29.84,42.55 29.84,43.18 29.21,43.81 29.21,47.8 IC4.11
PB7(AU_CDIN)  (via drill 0.6 pad 1.27)
  Top 0.25: IC3.59 29.86,40.62 28.41,42.07 v28.41,43.23
  Bottom 0.25: IC4.12 28.47,45.09 | 28.47,45.09 28.47,43.28 v28.41,43.23 | R8.2 28.47,45.09
PB8(AU_RST)  (via drill 0.6 pad 1.27)
  Top 0.25: IC3.61 28.86,40.35 26.04,43.18 26.04,46.91 v26.12,47
  Bottom 0.25: v26.12,47 26.27,47 IC4.14
PB12(TFT_CS)
  Top 0.25: R4.1 43.81,16.93 42.55,18.2 42.55,24.13 41.27,25.4 41.27,26.67 40.58,27.36 IC3.33
PB13(TFT_SCK)
  Top 0.25: IC3.34 41.01,27.86 44.88,24 44.88,19.89 45.09,19.68 R5.1
PB14(TFT_MISO)
  Top 0.25: IC3.35 41.48,28.36 45.09,24.77 R6.1
PB15(TFT_MOSI)  (via drill 0.6 pad 1.27)
  Top 0.25: IC3.36 42.89,28.86 v43.81,27.94 | v45.09,17.14 R7.1
  Bottom 0.25: v43.81,27.94 45.09,25.4 v45.09,17.14
PC0(GPIO)
  Top 0.25: IC3.8 14.57,31.36 R23.2
PC1(GPIO)
  Top 0.25: IC3.9 13.47,30.86 R24.2
PC2(GPIO)
  Top 0.25: IC3.10 17.03,30.36 14.61,27.94 R25.2
PC3(GPIO)
  Top 0.25: IC3.11 18.43,29.86 13.97,25.4 R26.2
PC6(TFT_RESET)  (via drill 0.6 pad 1.27)
  Top 0.25: IC3.37 44.93,29.36 v45.72,27.94 | v49.53,12.06 LCD.6
  Bottom 0.25: v45.72,27.94 46.35,27.3 46.35,15.24 v49.53,12.06
PC7(TFT_D_C)  (via drill 0.6 pad 1.27)
  Top 0.25: IC3.38 46.34,29.86 v47.62,27.94 | v48.26,15.24 48.9,14.61 R21.1
  Bottom 0.25: v47.62,27.94 47.62,16.51 v48.26,15.24
PC8(TFT_LED)  (via drill 0.6 pad 1.27)
  Top 0.25: IC3.39 47.74,30.36 v49.53,27.94 | v48.9,22.23 R20.1
  Bottom 0.305: v49.53,27.94 49.53,27.3 48.9,26.67 v48.9,22.23
PC10(SPI3_SCK)  (via drill 0.6 pad 1.27)
  Top 0.25: IC3.51 33.87,39.58 v34.29,40.01
  Bottom 0.25: v34.29,40.01 34.92,40.01 35.56,40.64 R9.1
PC12(I2S3_SD)  (via drill 0.6 pad 1.27)
  Top 0.25: v32.38,40.64 32.38,40.01 32.87,39.52 IC3.53
  Bottom 0.25: R10.1 33.44,41.7 v32.38,40.64
SW_A  (via drill 0.6 pad 1.27)  (1 unrouted)
  Top 0.305: v33.66,63.5 v22.23,63.5 v20.32,63.5 | R23.1 11.21,35.34 v11.43,35.56
  Top 0.406: R23.1 GPIO.1 C3.1
  Bottom 0.305: U$1.6 34.19,64.03 v33.66,63.5 | v22.23,63.5 23.29,63.5 U$2.6
SWDCLK
  Top 0.25: IC3.49 34.87,37.41 35.56,38.1 36.2,38.1 36.83,38.73 43.18,38.73 45.09,40.64 45.09,43.18 SWD.3
SWDIO
  Top 0.25: IC3.46 43.39,33.87 44.45,34.92 44.45,38.73 45.72,40.01 46.99,40.01 SWD.2
USB_DM
  Top 0.25: IC3.44 50.24,32.87 R3.1
USB_DP
  Top 0.25: IC3.45 47.34,33.37 48.9,34.92 R12.1
VCOM  (1 unrouted)
  Bottom 0.25: C20.1 23.07,55.24 | 23.07,55.24 C22.1 | IC4.15 27.15,54.13 26.04,55.24 25.4,55.24 23.07,55.24
  Bottom 0.305: R34.1 32.06,58.52 C27.1 31.75,56.84 31.75,56.52 29.79,54.56 IC4.19 29.79,52.65 29.21,52.07 28.57,52.07 27.81,52.83 IC4.16 IC4.15 | 25.4,55.24 25.72,55.56 C28.2 25.4,57.47 R32.1